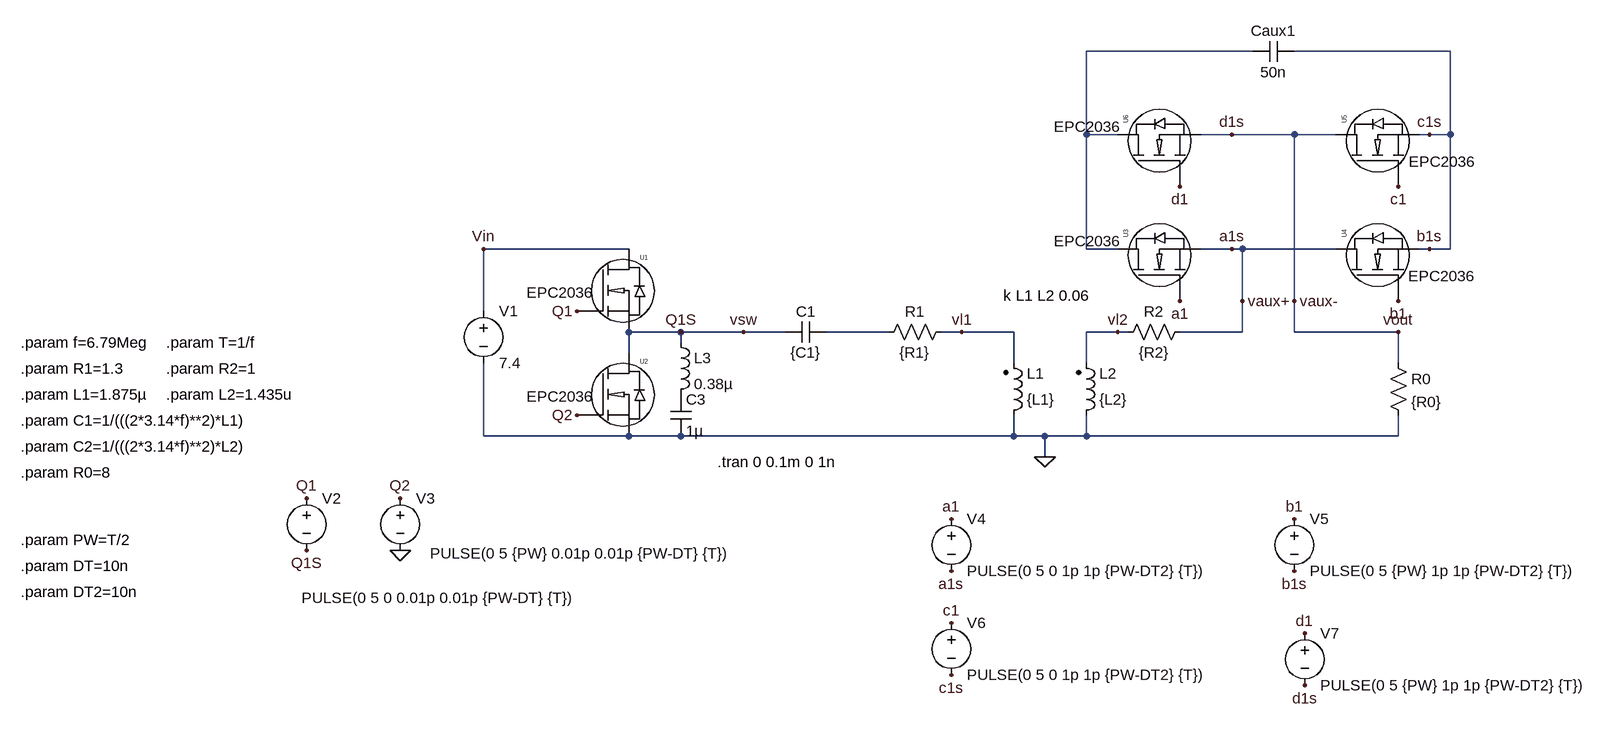
[diagram p0: schematic WPT_inv_aux.asc]
WPT_inv_aux.asc, the LTspice schematic file:
Version 4
SHEET 1 2368 1192
WIRE -320 64 -576 64
WIRE -16 64 -256 64
WIRE -576 192 -576 64
WIRE -528 192 -576 192
WIRE -352 192 -400 192
WIRE -256 192 -352 192
WIRE -192 192 -256 192
WIRE -48 192 -64 192
WIRE -16 192 -16 64
WIRE -16 192 -48 192
WIRE -1280 368 -1504 368
WIRE -576 368 -576 192
WIRE -528 368 -576 368
WIRE -352 368 -400 368
WIRE -336 368 -352 368
WIRE -192 368 -336 368
WIRE -48 368 -64 368
WIRE -16 368 -16 192
WIRE -16 368 -48 368
WIRE -336 448 -336 368
WIRE -256 448 -256 192
WIRE -1504 464 -1504 368
WIRE -1200 496 -1280 496
WIRE -1104 496 -1200 496
WIRE -1040 496 -1104 496
WIRE -880 496 -976 496
WIRE -768 496 -800 496
WIRE -688 496 -768 496
WIRE -528 496 -576 496
WIRE -512 496 -528 496
WIRE -336 496 -336 448
WIRE -336 496 -432 496
WIRE -256 496 -256 448
WIRE -96 496 -256 496
WIRE -1200 512 -1200 496
WIRE -1280 528 -1280 496
WIRE -688 544 -688 496
WIRE -576 544 -576 496
WIRE -96 544 -96 496
WIRE -1504 656 -1504 544
WIRE -1280 656 -1504 656
WIRE -1200 656 -1280 656
WIRE -688 656 -688 624
WIRE -688 656 -1200 656
WIRE -640 656 -688 656
WIRE -576 656 -576 624
WIRE -576 656 -640 656
WIRE -96 656 -96 624
WIRE -96 656 -576 656
WIRE -640 688 -640 656
FLAG -640 688 0
FLAG -768 496 vl1
FLAG -528 496 vl2
FLAG -1360 464 Q1
FLAG -1360 624 Q2
FLAG -1632 832 0
FLAG -1200 496 Q1S
FLAG -1776 832 Q1S
FLAG -1504 368 Vin
FLAG -1776 752 Q1
FLAG -1632 752 Q2
FLAG -1104 496 vsw
FLAG -96 496 vout
FLAG -432 448 a1
FLAG -96 272 c1
FLAG -96 448 b1
FLAG -432 272 d1
FLAG -256 448 vaux-
FLAG -352 368 a1s
FLAG -352 192 d1s
FLAG -48 368 b1s
FLAG -48 192 c1s
FLAG -784 784 a1
FLAG -256 784 b1
FLAG -784 864 a1s
FLAG -256 864 b1s
FLAG -784 944 c1
FLAG -240 960 d1
FLAG -784 1024 c1s
FLAG -240 1040 d1s
FLAG -336 448 vaux+
SYMBOL cap -976 480 R90
WINDOW 0 0 32 VBottom 2
WINDOW 3 32 32 VTop 2
SYMATTR InstName C1
SYMATTR Value {C1}
SYMBOL ind2 -704 640 M180
WINDOW 0 36 80 Left 2
WINDOW 3 36 40 Left 2
SYMATTR InstName L1
SYMATTR Value {L1}
SYMATTR Type ind
SYMBOL ind2 -592 640 M180
WINDOW 0 36 80 Left 2
WINDOW 3 36 40 Left 2
SYMATTR InstName L2
SYMATTR Value {L2}
SYMATTR Type ind
SYMBOL res -784 480 R90
WINDOW 0 0 56 VBottom 2
WINDOW 3 32 56 VTop 2
SYMATTR InstName R1
SYMATTR Value {R1}
SYMBOL res -416 480 R90
WINDOW 0 0 56 VBottom 2
WINDOW 3 32 56 VTop 2
SYMATTR InstName R2
SYMATTR Value {R2}
SYMBOL voltage -1776 736 R0
WINDOW 123 0 0 Left 0
WINDOW 39 0 0 Left 0
WINDOW 3 -8 169 Left 2
SYMATTR Value PULSE(0 5 0 0.01p 0.01p {PW-DT} {T})
SYMATTR InstName V2
SYMBOL EPCGaN -1360 464 R0
WINDOW 3 -78 -29 Left 2
SYMATTR Value EPC2036
SYMATTR InstName U1
SYMBOL EPCGaN -1360 624 R0
WINDOW 3 -78 -29 Left 2
SYMATTR Value EPC2036
SYMATTR InstName U2
SYMBOL voltage -1504 448 R0
WINDOW 123 0 0 Left 0
WINDOW 39 0 0 Left 0
SYMATTR InstName V1
SYMATTR Value 7.4
SYMBOL voltage -1632 736 R0
WINDOW 123 0 0 Left 0
WINDOW 39 0 0 Left 0
WINDOW 3 46 101 Left 2
SYMATTR Value PULSE(0 5 {PW} 0.01p 0.01p {PW-DT} {T})
SYMATTR InstName V3
SYMBOL cap -1216 592 R0
SYMATTR InstName C3
SYMATTR Value 1µ
SYMBOL ind -1216 496 R0
SYMATTR InstName L3
SYMATTR Value 0.38µ
SYMBOL res -112 528 R0
SYMATTR InstName R0
SYMATTR Value {R0}
SYMBOL cap -256 48 R90
WINDOW 0 0 32 VBottom 2
WINDOW 3 32 32 VTop 2
SYMATTR InstName Caux1
SYMATTR Value 50n
SYMBOL EPCGaN -432 448 R270
WINDOW 3 92 -194 VRight 2
SYMATTR Value EPC2036
SYMATTR InstName U3
SYMBOL EPCGaN -96 448 R270
WINDOW 3 38 15 VRight 2
SYMATTR Value EPC2036
SYMATTR InstName U4
SYMBOL EPCGaN -96 272 R270
WINDOW 3 38 16 VRight 2
SYMATTR Value EPC2036
SYMATTR InstName U5
SYMBOL EPCGaN -432 272 R270
WINDOW 3 92 -194 VRight 2
SYMATTR Value EPC2036
SYMATTR InstName U6
SYMBOL voltage -784 768 R0
WINDOW 123 0 0 Left 0
WINDOW 39 24 124 Left 2
SYMATTR InstName V4
SYMATTR Value PULSE(0 5 0 1p 1p {PW-DT2} {T})
SYMBOL voltage -256 768 R0
WINDOW 123 0 0 Left 0
WINDOW 39 24 124 Left 2
SYMATTR InstName V5
SYMATTR Value PULSE(0 5 {PW} 1p 1p {PW-DT2} {T})
SYMBOL voltage -784 928 R0
WINDOW 123 0 0 Left 0
WINDOW 39 24 124 Left 2
SYMATTR InstName V6
SYMATTR Value PULSE(0 5 0 1p 1p {PW-DT2} {T})
SYMBOL voltage -240 944 R0
WINDOW 123 0 0 Left 0
WINDOW 39 24 124 Left 2
SYMATTR InstName V7
SYMATTR Value PULSE(0 5 {PW} 1p 1p {PW-DT2} {T})
TEXT -704 440 Left 2 !k L1 L2 0.06
TEXT -1144 696 Left 2 !.tran 0 0.1m 0 1n
TEXT -2216 816 Left 2 !.param PW=T/2
TEXT -2216 856 Left 2 !.param DT=10n
TEXT -2216 592 Left 2 !.param L1=1.875µ
TEXT -2216 552 Left 2 !.param R1=1.3
TEXT -2216 632 Left 2 !.param C1=1/(((2*3.14*f)**2)*L1)
TEXT -2216 512 Left 2 !.param f=6.79Meg
TEXT -1992 512 Left 2 !.param T=1/f
TEXT -1992 552 Left 2 !.param R2=1
TEXT -1992 592 Left 2 !.param L2=1.435u
TEXT -2216 672 Left 2 !.param C2=1/(((2*3.14*f)**2)*L2)
TEXT -2216 712 Left 2 !.param R0=8
TEXT -2216 896 Left 2 !.param DT2=10n

The netlist it stands for:
* WPT_inv_aux.asc
C1 N002 vsw {C1}
L1 0 vl1 {L1}
L2 0 vl2 {L2}
R1 vl1 N002 {R1}
R2 vaux+ vl2 {R2}
V2 Q1 vsw PULSE(0 5 0 0.01p 0.01p {PW-DT} {T})
XU1 Q1 Vin vsw EPC2036  ; pins gatein drainin N_0
XU2 Q2 vsw 0 EPC2036  ; pins gatein drainin N_0
V1 Vin 0 7.4
V3 Q2 0 PULSE(0 5 {PW} 0.01p 0.01p {PW-DT} {T})
C3 P001 0 1µ
L3 vsw P001 0.38µ
R0 d1s 0 {R0}
Caux1 c1s N001 50n
XU3 a1 N001 vaux+ EPC2036  ; pins gatein drainin N_0
XU4 b1 vaux+ c1s EPC2036  ; pins gatein drainin N_0
XU5 c1 d1s c1s EPC2036  ; pins gatein drainin N_0
XU6 d1 N001 d1s EPC2036  ; pins gatein drainin N_0
V4 a1 vaux+ PULSE(0 5 0 1p 1p {PW-DT2} {T})
V5 b1 c1s PULSE(0 5 {PW} 1p 1p {PW-DT2} {T})
V6 c1 c1s PULSE(0 5 0 1p 1p {PW-DT2} {T})
V7 d1 d1s PULSE(0 5 {PW} 1p 1p {PW-DT2} {T})
k L1 L2 0.06
.tran 0 0.1m 0 1n
.param PW=T/2
.param DT=10n
.param L1=1.875µ
.param R1=1.3
.param C1=1/(((2*3.14*f)**2)*L1)
.param f=6.79Meg
.param T=1/f
.param R2=1
.param L2=1.435u
.param C2=1/(((2*3.14*f)**2)*L2)
.param R0=8
.param DT2=10n
.lib EPCGanlibrary.lib
.backanno
.end